# Altium schematic sheet GNDing.SchDoc
size A
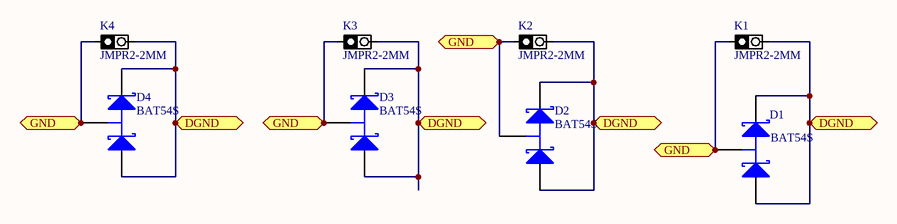
[diagram p0: GNDing.SchDoc]

## Parts
D1  BAT54S  [SOT23_N]
D2  BAT54S  [SOT23_N]
D3  BAT54S  [SOT23_N]
D4  BAT54S  [SOT23_N]
K1  JMPR2-2MM  [JMPR2-2MM]
K2  JMPR2-2MM  [JMPR2-2MM]
K3  JMPR2-2MM  [JMPR2-2MM]
K4  JMPR2-2MM  [JMPR2-2MM]

## Ports
DGND, GND

## Nets
DGND: D1.1(A) D1.2(K) D2.1(A) D2.2(K) D3.1(A) D3.2(K) D4.1(A) D4.2(K) K1.2 K2.2 K3.2 K4.2 ; port DGND
GND: D1.3(C) D2.3(C) D3.3(C) D4.3(C) K1.1 K2.1 K3.1 K4.1 ; port GND

## Library data of the parts
D1-D4 = BAT54S: Schottky Barrier Double Diode; Published: 17-Sep-2003; LatestRevisionDate: 12-Dec-2006; LatestRevisionNote: IPC-7351 Footprint Added.; DatasheetVersion: 4-Mar-2002; PackageVersion: May-1999; PackageReference: SOT23; Publisher: Altium Limited; PackageDescription: 3-Pin SOT-23 Package 0.95 mm Pitch, 2.3 mm Lead Span; ComponentLink1Description: Manufacturer Link; ComponentLink1URL: http://www.semiconductors.philips.com/; ComponentLink2Description: Datasheet; ComponentLink2URL: http://www.semiconductors.philips.com/acrobat/datasheets/BAT54_SERIES_4.pdf
K1-K4 = JMPR2-2MM: JMPR2 2MM OPEN BY DEFAULT; Manufacturer: Sullins Connector Solutions; Manufacturer Part Number: PBC36SAAN; Supplier 1: Digi-Key; Supplier Part Number 1: S1011E-36-ND; Reel: Open